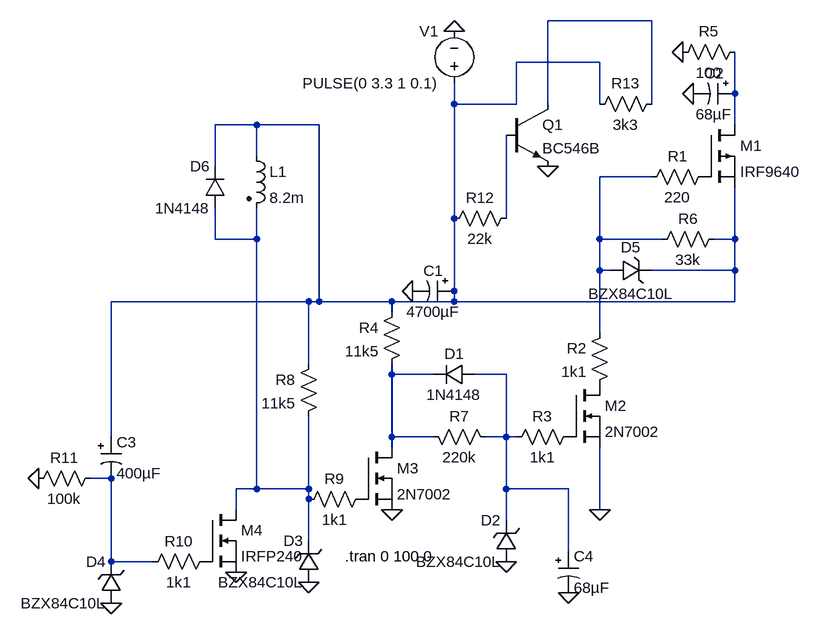
[diagram p0: schematic DELAYFET.asc]
DELAYFET.asc, the LTspice schematic file:
Version 4
SHEET 1 1072 680
WIRE 416 -240 256 -240
WIRE 336 -176 208 -176
WIRE 544 -128 544 -192
WIRE 112 -112 112 -144
WIRE 208 -112 208 -176
WIRE 208 -112 112 -112
WIRE 256 -112 256 -240
WIRE 336 -112 336 -176
WIRE 416 -112 416 -240
WIRE -192 -80 -256 -80
WIRE -96 -80 -192 -80
WIRE 544 -80 544 -128
WIRE -192 -32 -192 -80
WIRE -256 -16 -256 -80
WIRE 416 0 336 0
WIRE 112 64 112 -112
WIRE 192 64 192 -64
WIRE -256 96 -256 48
WIRE -192 96 -192 48
WIRE -192 96 -256 96
WIRE 336 96 336 0
WIRE 432 96 336 96
WIRE 544 96 544 16
WIRE 544 96 512 96
WIRE 336 144 336 96
WIRE 352 144 336 144
WIRE 544 144 544 96
WIRE 544 144 416 144
WIRE 112 176 112 64
WIRE -112 192 -416 192
WIRE -96 192 -96 -80
WIRE -96 192 -112 192
WIRE 16 192 -96 192
WIRE 112 192 112 176
WIRE 112 192 16 192
WIRE 544 192 544 144
WIRE 544 192 112 192
WIRE 16 208 16 192
WIRE 336 240 336 144
WIRE -112 288 -112 192
WIRE 16 304 16 288
WIRE 80 304 16 304
WIRE 192 304 144 304
WIRE -416 400 -416 192
WIRE 16 400 16 304
WIRE 80 400 16 400
WIRE 192 400 192 304
WIRE 192 400 160 400
WIRE 208 400 192 400
WIRE 16 416 16 400
WIRE -416 464 -448 464
WIRE -192 480 -192 96
WIRE -192 480 -224 480
WIRE -112 480 -112 368
WIRE -112 480 -192 480
WIRE 192 480 192 400
WIRE 288 480 192 480
WIRE -112 496 -112 480
WIRE -224 512 -224 480
WIRE 336 512 336 416
WIRE 192 528 192 480
WIRE -112 560 -112 496
WIRE 288 576 288 480
WIRE -416 592 -416 464
WIRE -352 592 -416 592
FLAG 112 -224 0
FLAG 464 -192 0
FLAG 480 -128 0
FLAG 48 176 0
FLAG 336 512 0
FLAG 16 512 0
FLAG 288 640 0
FLAG -224 608 0
FLAG -416 656 0
FLAG -112 624 0
FLAG 192 592 0
FLAG -528 464 0
FLAG 256 -16 0
SYMBOL voltage 112 -128 R180
WINDOW 0 24 96 Left 2
WINDOW 3 24 16 Left 2
WINDOW 123 0 0 Left 2
WINDOW 39 0 0 Left 2
SYMATTR InstName V1
SYMATTR Value PULSE(0 3.3 1 0.1)
SYMBOL nmos 288 320 R0
SYMATTR InstName M2
SYMATTR Value 2N7002
SYMBOL polcap 272 576 R0
SYMATTR Value 68µF
SYMATTR InstName C4
SYMATTR Description Capacitor
SYMATTR Type cap
SYMATTR SpiceLine V=4 Irms=1 Rser=0.07 Lser=0
SYMBOL zener 352 160 R270
WINDOW 0 36 32 VTop 2
WINDOW 3 -4 32 VBottom 2
SYMATTR InstName D5
SYMATTR Value BZX84C10L
SYMBOL res 512 -16 R90
WINDOW 0 0 56 VBottom 2
WINDOW 3 32 56 VTop 2
SYMATTR InstName R1
SYMATTR Value 220
SYMBOL res 528 80 R90
WINDOW 0 0 56 VBottom 2
WINDOW 3 32 56 VTop 2
SYMATTR InstName R6
SYMATTR Value 33k
SYMBOL res 352 224 M0
SYMATTR InstName R2
SYMATTR Value 1k1
SYMBOL pmos 496 -80 R0
SYMATTR InstName M1
SYMATTR Value IRF9640
SYMBOL res 304 384 R90
WINDOW 0 0 56 VBottom 2
WINDOW 3 32 56 VTop 2
SYMATTR InstName R3
SYMATTR Value 1k1
SYMBOL polcap 112 160 R90
WINDOW 3 32 32 VTop 2
WINDOW 0 0 32 VBottom 2
SYMATTR Value 4700µF
SYMATTR InstName C1
SYMATTR Description Capacitor
SYMATTR Type cap
SYMATTR SpiceLine V=4 Irms=1 Rser=0.07 Lser=0
SYMBOL polcap 544 -144 R90
WINDOW 3 32 32 VTop 2
WINDOW 0 0 32 VBottom 2
SYMATTR Value 68µF
SYMATTR InstName C2
SYMATTR Description Capacitor
SYMATTR Type cap
SYMATTR SpiceLine V=4 Irms=1 Rser=0.07 Lser=0
SYMBOL res 560 -208 R90
WINDOW 0 0 56 VBottom 2
WINDOW 3 32 56 VTop 2
SYMATTR InstName R5
SYMATTR Value 100
SYMBOL nmos -32 416 R0
SYMATTR InstName M3
SYMATTR Value 2N7002
SYMBOL res 176 416 M270
WINDOW 0 32 56 VTop 2
WINDOW 3 0 56 VBottom 2
SYMATTR InstName R7
SYMATTR Value 220k
SYMBOL diode 144 288 R90
WINDOW 0 0 32 VBottom 2
WINDOW 3 32 32 VTop 2
SYMATTR InstName D1
SYMATTR Value 1N4148
SYMBOL res 32 192 M0
SYMATTR InstName R4
SYMATTR Value 11k5
SYMBOL res -96 272 M0
SYMATTR InstName R8
SYMATTR Value 11k5
SYMBOL res -16 480 R90
WINDOW 0 0 56 VBottom 2
WINDOW 3 32 56 VTop 2
SYMATTR InstName R9
SYMATTR Value 1k1
SYMBOL nmos -272 512 R0
SYMATTR InstName M4
SYMATTR Value IRFP240
SYMBOL res -256 576 R90
WINDOW 0 0 56 VBottom 2
WINDOW 3 32 56 VTop 2
SYMATTR InstName R10
SYMATTR Value 1k1
SYMBOL zener 208 592 R180
WINDOW 0 24 64 Left 2
WINDOW 3 24 0 Left 2
SYMATTR InstName D2
SYMATTR Value BZX84C10L
SYMBOL zener -96 624 R180
WINDOW 0 24 64 Left 2
WINDOW 3 24 0 Left 2
SYMATTR InstName D3
SYMATTR Value BZX84C10L
SYMBOL zener -400 656 R180
WINDOW 0 24 64 Left 2
WINDOW 3 24 0 Left 2
SYMATTR InstName D4
SYMATTR Value BZX84C10L
SYMBOL ind2 -208 -48 R0
SYMATTR InstName L1
SYMATTR Value 8.2m
SYMATTR SpiceLine Ipk=45m Rser=92 Rpar=107.08Meg Cpar=0 mfg="Bourns, Inc." pn="SDR0503-822JL"
SYMBOL diode -240 48 R180
WINDOW 0 24 64 Left 2
WINDOW 3 24 0 Left 2
SYMATTR InstName D6
SYMATTR Value 1N4148
SYMBOL res -432 448 R90
WINDOW 0 0 56 VBottom 2
WINDOW 3 32 56 VTop 2
SYMATTR InstName R11
SYMATTR Value 100k
SYMBOL polcap -432 400 R0
SYMATTR Value 400µF
SYMATTR InstName C3
SYMATTR Description Capacitor
SYMATTR Type cap
SYMATTR SpiceLine V=4 Irms=1 Rser=0.07 Lser=0
SYMBOL res 208 48 R90
WINDOW 0 0 56 VBottom 2
WINDOW 3 32 56 VTop 2
SYMATTR InstName R12
SYMATTR Value 22k
SYMBOL npn 192 -112 R0
SYMATTR InstName Q1
SYMATTR Value BC546B
SYMBOL res 432 -128 R90
WINDOW 0 0 56 VBottom 2
WINDOW 3 32 56 VTop 2
SYMATTR InstName R13
SYMATTR Value 3k3
TEXT -56 584 Left 2 !.tran 0 100 0

The netlist it stands for:
* DELAYFET.asc
V1 N002 0 PULSE(0 3.3 1 0.1)
M2 P001 P002 0 0 2N7002
C4 N008 0 68µF V=4 Irms=1 Rser=0.07 Lser=0
D5 N004 N002 BZX84C10L
R1 P003 N004 220
R6 N002 N004 33k
R2 N004 P001 1k1
M1 N003 P003 N002 N002 IRF9640
R3 P002 N008 1k1
C1 N002 0 4700µF V=4 Irms=1 Rser=0.07 Lser=0
C2 N003 0 68µF V=4 Irms=1 Rser=0.07 Lser=0
R5 N003 0 100
M3 N007 P004 0 0 2N7002
R7 N008 N007 220k
D1 N008 N007 1N4148
R4 N002 N007 11k5
R8 N002 N006 11k5
R9 P004 N006 1k1
M4 N006 P005 0 0 IRFP240
R10 P005 N009 1k1
D2 0 N008 BZX84C10L
D3 0 N006 BZX84C10L
D4 0 N009 BZX84C10L
L1 N002 N006 8.2m Ipk=45m Rser=92 Rpar=107.08Meg Cpar=0 mfg="Bourns, Inc." pn="SDR0503-822JL"
D6 N006 N002 1N4148
R11 N009 0 100k
C3 N002 N009 400µF V=4 Irms=1 Rser=0.07 Lser=0
R12 N005 N002 22k
Q1 N001 N005 0 0 BC546B
R13 N001 N002 3k3
.model D D
.lib standard.dio
.model NPN NPN
.model PNP PNP
.lib standard.bjt
.model NMOS NMOS
.model PMOS PMOS
.lib standard.mos
.tran 0 100 0
.backanno
.end